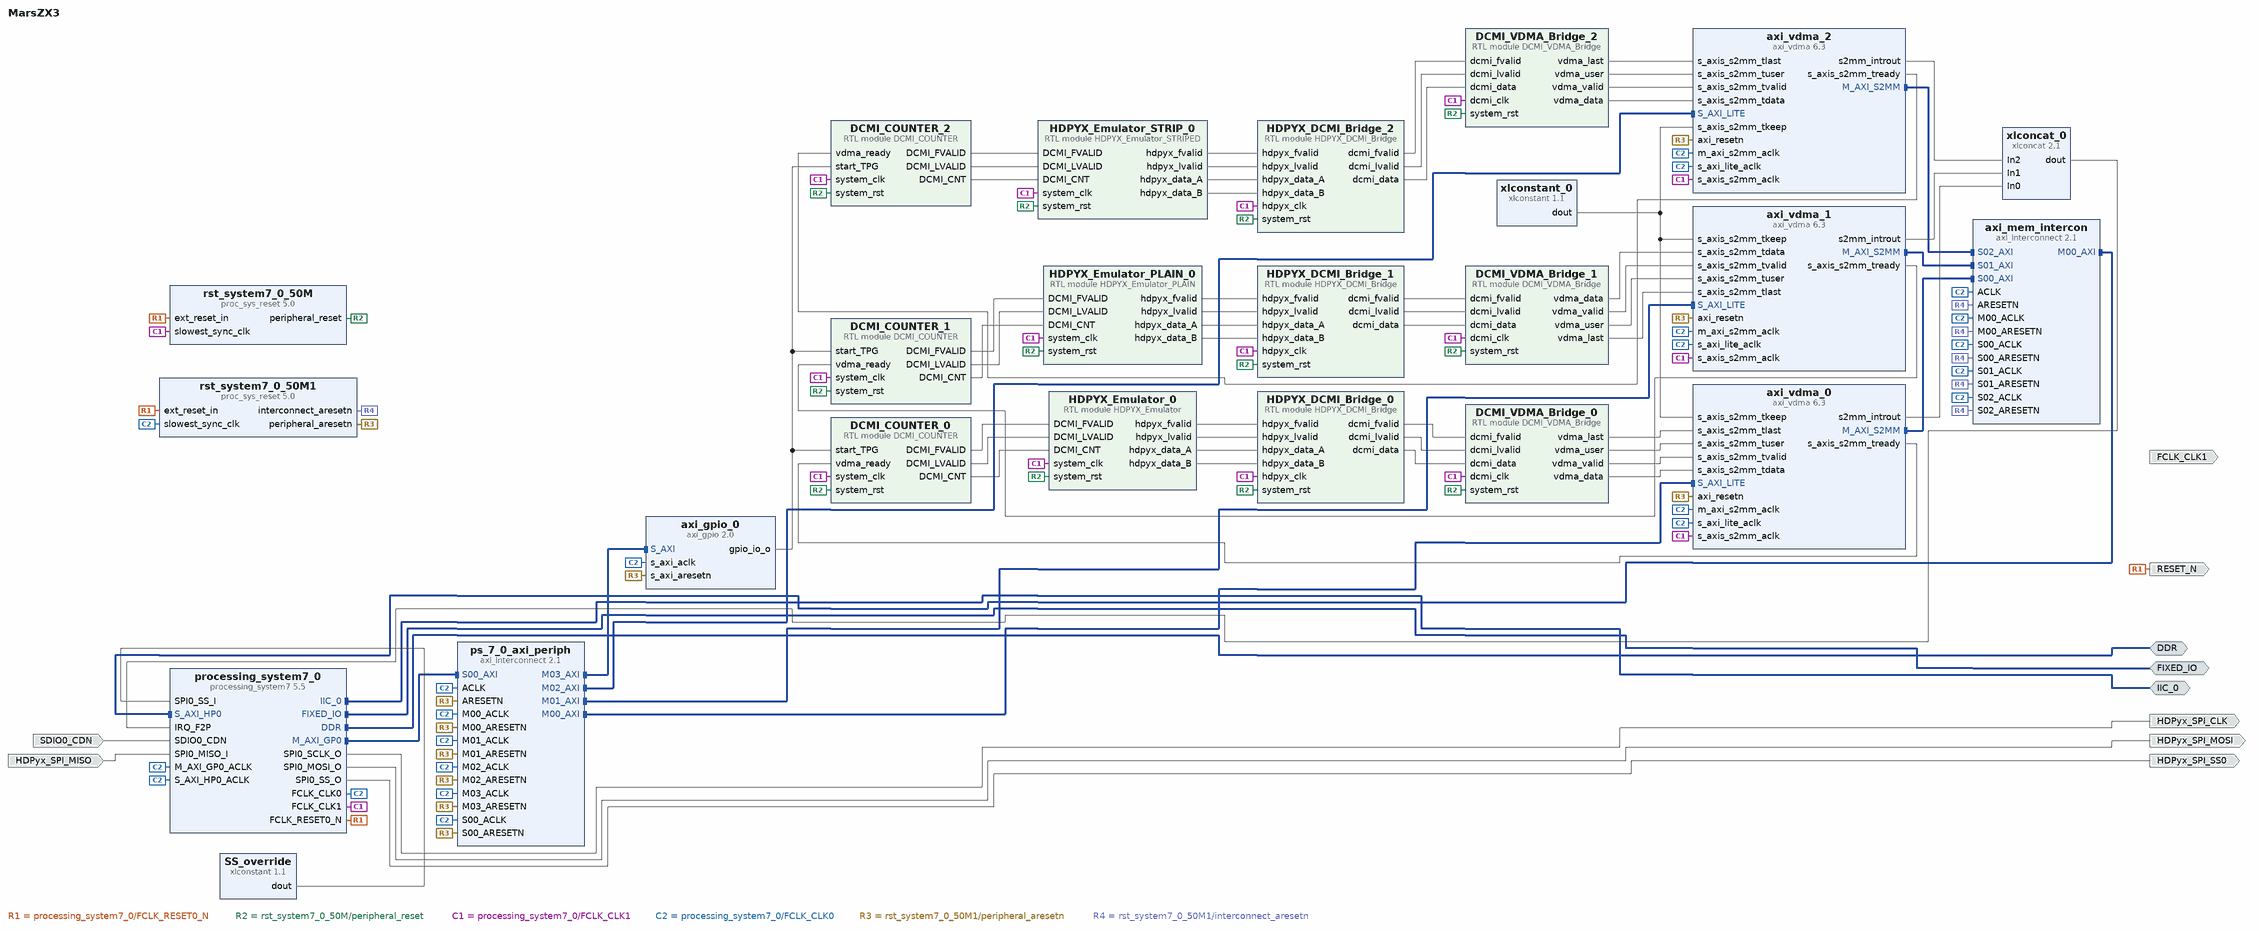
[diagram p0: block diagram of the top level]
# Vivado block design MarsZX3, xc7z020clg484-1, Vivado 2019.1
create_bd_design MarsZX3

create_bd_intf_port -mode Master -vlnv xilinx.com:interface:ddrx_rtl:1.0 DDR
create_bd_intf_port -mode Master -vlnv xilinx.com:display_processing_system7:fixedio_rtl:1.0 FIXED_IO
create_bd_intf_port -mode Master -vlnv xilinx.com:interface:iic_rtl:1.0 IIC_0
create_bd_port -dir I SDIO0_CDN
create_bd_port -dir O -type clk FCLK_CLK1
create_bd_port -dir O RESET_N
create_bd_port -dir O -type clk HDPyx_SPI_CLK
create_bd_port -dir O HDPyx_SPI_MOSI
create_bd_port -dir I HDPyx_SPI_MISO
create_bd_port -dir O HDPyx_SPI_SS0

create_bd_cell -type ip -vlnv xilinx.com:ip:processing_system7:5.5 processing_system7_0
set_property -dict [list \
  CONFIG.PCW_APU_PERIPHERAL_FREQMHZ 666.666666 \
  CONFIG.PCW_ENET0_ENET0_IO {MIO 16 .. 27} \
  CONFIG.PCW_ENET0_GRP_MDIO_ENABLE 1 \
  CONFIG.PCW_ENET0_GRP_MDIO_IO {MIO 52 .. 53} \
  CONFIG.PCW_ENET0_PERIPHERAL_ENABLE 1 \
  CONFIG.PCW_ENET_RESET_ENABLE 0 \
  CONFIG.PCW_EN_CLK1_PORT 1 \
  CONFIG.PCW_FCLK_CLK1_BUF TRUE \
  CONFIG.PCW_FPGA0_PERIPHERAL_FREQMHZ 100 \
  CONFIG.PCW_FPGA1_PERIPHERAL_FREQMHZ 50 \
  CONFIG.PCW_FPGA2_PERIPHERAL_FREQMHZ 40 \
  CONFIG.PCW_FPGA3_PERIPHERAL_FREQMHZ 33.333 \
  CONFIG.PCW_FPGA_FCLK1_ENABLE 1 \
  CONFIG.PCW_GP0_EN_MODIFIABLE_TXN 0 \
  CONFIG.PCW_GP1_EN_MODIFIABLE_TXN 0 \
  CONFIG.PCW_GPIO_MIO_GPIO_ENABLE 1 \
  CONFIG.PCW_GPIO_MIO_GPIO_IO MIO \
  CONFIG.PCW_I2C0_I2C0_IO EMIO \
  CONFIG.PCW_I2C0_PERIPHERAL_ENABLE 1 \
  CONFIG.PCW_I2C_PERIPHERAL_FREQMHZ 111.111115 \
  CONFIG.PCW_I2C_RESET_ENABLE 0 \
  CONFIG.PCW_IRQ_F2P_INTR 1 \
  CONFIG.PCW_PERIPHERAL_BOARD_PRESET None \
  CONFIG.PCW_PRESET_BANK0_VOLTAGE {LVCMOS 2.5V} \
  CONFIG.PCW_PRESET_BANK1_VOLTAGE {LVCMOS 2.5V} \
  CONFIG.PCW_QSPI_GRP_FBCLK_ENABLE 1 \
  CONFIG.PCW_QSPI_GRP_FBCLK_IO {MIO 8} \
  CONFIG.PCW_QSPI_GRP_SINGLE_SS_ENABLE 1 \
  CONFIG.PCW_QSPI_GRP_SINGLE_SS_IO {MIO 1 .. 6} \
  CONFIG.PCW_QSPI_PERIPHERAL_ENABLE 1 \
  CONFIG.PCW_QSPI_PERIPHERAL_FREQMHZ 125 \
  CONFIG.PCW_QSPI_QSPI_IO {MIO 1 .. 6} \
  CONFIG.PCW_SD0_GRP_CD_ENABLE 1 \
  CONFIG.PCW_SD0_GRP_CD_IO EMIO \
  CONFIG.PCW_SD0_GRP_WP_ENABLE 1 \
  CONFIG.PCW_SD0_GRP_WP_IO EMIO \
  CONFIG.PCW_SD0_PERIPHERAL_ENABLE 1 \
  CONFIG.PCW_SD0_SD0_IO {MIO 40 .. 45} \
  CONFIG.PCW_SDIO_PERIPHERAL_FREQMHZ 50 \
  CONFIG.PCW_SINGLE_QSPI_DATA_MODE x4 \
  CONFIG.PCW_SPI0_PERIPHERAL_ENABLE 1 \
  CONFIG.PCW_SPI0_SPI0_IO EMIO \
  CONFIG.PCW_TPIU_PERIPHERAL_CLKSRC {IO PLL} \
  CONFIG.PCW_TTC0_PERIPHERAL_ENABLE 1 \
  CONFIG.PCW_TTC0_TTC0_IO EMIO \
  CONFIG.PCW_UART0_PERIPHERAL_ENABLE 1 \
  CONFIG.PCW_UART0_UART0_IO {MIO 46 .. 47} \
  CONFIG.PCW_UART1_PERIPHERAL_ENABLE 0 \
  CONFIG.PCW_UART_PERIPHERAL_FREQMHZ 100 \
  CONFIG.PCW_UIPARAM_DDR_FREQ_MHZ 400 \
  CONFIG.PCW_UIPARAM_DDR_MEMORY_TYPE {DDR 3 (Low Voltage)} \
  CONFIG.PCW_UIPARAM_DDR_PARTNO Custom \
  CONFIG.PCW_USB0_PERIPHERAL_ENABLE 1 \
  CONFIG.PCW_USB0_USB0_IO {MIO 28 .. 39} \
  CONFIG.PCW_USB_RESET_ENABLE 0 \
  CONFIG.PCW_USE_FABRIC_INTERRUPT 1 \
  CONFIG.PCW_USE_S_AXI_HP0 1 \
  CONFIG.PCW_WDT_PERIPHERAL_ENABLE 1 \
  CONFIG.PCW_WDT_WDT_IO EMIO \
] [get_bd_cells processing_system7_0]
# 522 more settings of processing_system7_0 are not shown: defaults, MIO pin electricals, DDR timing, and values the tool derives
create_bd_cell -type ip -vlnv xilinx.com:ip:axi_gpio:2.0 axi_gpio_0
set_property -dict {CONFIG.C_ALL_OUTPUTS 1 CONFIG.C_GPIO_WIDTH 1} [get_bd_cells axi_gpio_0]
create_bd_cell -type ip -vlnv xilinx.com:ip:axi_interconnect:2.1 axi_mem_intercon
set_property -dict {CONFIG.NUM_MI 1 CONFIG.NUM_SI 3 CONFIG.SYNCHRONIZATION_STAGES 2} [get_bd_cells axi_mem_intercon]
create_bd_cell -type ip -vlnv xilinx.com:ip:axi_interconnect:2.1 ps_7_0_axi_periph
set_property -dict {CONFIG.NUM_MI 4 CONFIG.SYNCHRONIZATION_STAGES 2} [get_bd_cells ps_7_0_axi_periph]
create_bd_cell -type ip -vlnv xilinx.com:ip:proc_sys_reset:5.0 rst_system7_0_50M
create_bd_cell -type ip -vlnv xilinx.com:ip:xlconstant:1.1 SS_override
create_bd_cell -type ip -vlnv xilinx.com:ip:axi_vdma:6.3 axi_vdma_0
set_property -dict [list \
  CONFIG.c_include_mm2s 0 \
  CONFIG.c_include_s2mm_dre 1 \
  CONFIG.c_num_fstores 3 \
  CONFIG.c_s2mm_max_burst_length 2 \
  CONFIG.c_use_s2mm_fsync 0 \
] [get_bd_cells axi_vdma_0]
create_bd_cell -type module -reference DCMI_VDMA_Bridge DCMI_VDMA_Bridge_0
create_bd_cell -type ip -vlnv xilinx.com:ip:xlconstant:1.1 xlconstant_0
set_property -dict {CONFIG.CONST_VAL 3 CONFIG.CONST_WIDTH 2} [get_bd_cells xlconstant_0]
create_bd_cell -type module -reference DCMI_VDMA_Bridge DCMI_VDMA_Bridge_1
create_bd_cell -type module -reference DCMI_VDMA_Bridge DCMI_VDMA_Bridge_2
create_bd_cell -type ip -vlnv xilinx.com:ip:axi_vdma:6.3 axi_vdma_1
set_property -dict [list \
  CONFIG.c_include_mm2s 0 \
  CONFIG.c_include_s2mm_dre 1 \
  CONFIG.c_num_fstores 3 \
  CONFIG.c_s2mm_max_burst_length 2 \
  CONFIG.c_use_s2mm_fsync 0 \
] [get_bd_cells axi_vdma_1]
create_bd_cell -type ip -vlnv xilinx.com:ip:axi_vdma:6.3 axi_vdma_2
set_property -dict [list \
  CONFIG.c_include_mm2s 0 \
  CONFIG.c_include_s2mm_dre 1 \
  CONFIG.c_num_fstores 3 \
  CONFIG.c_s2mm_max_burst_length 2 \
  CONFIG.c_use_s2mm_fsync 0 \
] [get_bd_cells axi_vdma_2]
create_bd_cell -type ip -vlnv xilinx.com:ip:xlconcat:2.1 xlconcat_0
set_property -dict {CONFIG.NUM_PORTS 3} [get_bd_cells xlconcat_0]
create_bd_cell -type ip -vlnv xilinx.com:ip:proc_sys_reset:5.0 rst_system7_0_50M1
create_bd_cell -type module -reference HDPYX_DCMI_Bridge HDPYX_DCMI_Bridge_0
create_bd_cell -type module -reference HDPYX_DCMI_Bridge HDPYX_DCMI_Bridge_1
create_bd_cell -type module -reference HDPYX_DCMI_Bridge HDPYX_DCMI_Bridge_2
create_bd_cell -type module -reference DCMI_COUNTER DCMI_COUNTER_0
create_bd_cell -type module -reference DCMI_COUNTER DCMI_COUNTER_1
create_bd_cell -type module -reference DCMI_COUNTER DCMI_COUNTER_2
create_bd_cell -type module -reference HDPYX_Emulator HDPYX_Emulator_0
create_bd_cell -type module -reference HDPYX_Emulator_PLAIN HDPYX_Emulator_PLAIN_0
create_bd_cell -type module -reference HDPYX_Emulator_STRIPED HDPYX_Emulator_STRIP_0

# ---- connections ----

connect_bd_intf_net [get_bd_intf_ports IIC_0] [get_bd_intf_pins processing_system7_0/IIC_0]
connect_bd_intf_net [get_bd_intf_ports FIXED_IO] [get_bd_intf_pins processing_system7_0/FIXED_IO]
connect_bd_intf_net [get_bd_intf_pins ps_7_0_axi_periph/S00_AXI] [get_bd_intf_pins processing_system7_0/M_AXI_GP0]
connect_bd_intf_net [get_bd_intf_pins axi_mem_intercon/M00_AXI] [get_bd_intf_pins processing_system7_0/S_AXI_HP0]
connect_bd_intf_net [get_bd_intf_pins ps_7_0_axi_periph/M02_AXI] [get_bd_intf_pins axi_vdma_2/S_AXI_LITE]
connect_bd_intf_net [get_bd_intf_ports DDR] [get_bd_intf_pins processing_system7_0/DDR]
connect_bd_intf_net [get_bd_intf_pins ps_7_0_axi_periph/M01_AXI] [get_bd_intf_pins axi_vdma_1/S_AXI_LITE]
connect_bd_intf_net [get_bd_intf_pins axi_gpio_0/S_AXI] [get_bd_intf_pins ps_7_0_axi_periph/M03_AXI]
connect_bd_intf_net [get_bd_intf_pins axi_vdma_2/M_AXI_S2MM] [get_bd_intf_pins axi_mem_intercon/S02_AXI]
connect_bd_intf_net [get_bd_intf_pins axi_mem_intercon/S00_AXI] [get_bd_intf_pins axi_vdma_0/M_AXI_S2MM]
connect_bd_intf_net [get_bd_intf_pins axi_vdma_0/S_AXI_LITE] [get_bd_intf_pins ps_7_0_axi_periph/M00_AXI]
connect_bd_intf_net [get_bd_intf_pins axi_vdma_1/M_AXI_S2MM] [get_bd_intf_pins axi_mem_intercon/S01_AXI]
connect_bd_net [get_bd_ports SDIO0_CDN] [get_bd_pins processing_system7_0/SDIO0_CDN]
connect_bd_net [get_bd_pins processing_system7_0/FCLK_RESET0_N] \
  [get_bd_ports RESET_N] [get_bd_pins rst_system7_0_50M/ext_reset_in] [get_bd_pins rst_system7_0_50M1/ext_reset_in]
connect_bd_net [get_bd_pins processing_system7_0/SPI0_SCLK_O] [get_bd_ports HDPyx_SPI_CLK]
connect_bd_net [get_bd_pins processing_system7_0/SPI0_MOSI_O] [get_bd_ports HDPyx_SPI_MOSI]
connect_bd_net [get_bd_ports HDPyx_SPI_MISO] [get_bd_pins processing_system7_0/SPI0_MISO_I]
connect_bd_net [get_bd_pins processing_system7_0/SPI0_SS_O] [get_bd_ports HDPyx_SPI_SS0]
connect_bd_net -net xlconstant_0_dout [get_bd_pins SS_override/dout] [get_bd_pins processing_system7_0/SPI0_SS_I]
connect_bd_net [get_bd_pins rst_system7_0_50M/peripheral_reset] \
  [get_bd_pins DCMI_VDMA_Bridge_0/system_rst] [get_bd_pins DCMI_VDMA_Bridge_1/system_rst] \
  [get_bd_pins DCMI_VDMA_Bridge_2/system_rst] [get_bd_pins HDPYX_DCMI_Bridge_0/system_rst] \
  [get_bd_pins HDPYX_DCMI_Bridge_1/system_rst] [get_bd_pins HDPYX_DCMI_Bridge_2/system_rst] \
  [get_bd_pins DCMI_COUNTER_0/system_rst] [get_bd_pins DCMI_COUNTER_1/system_rst] [get_bd_pins DCMI_COUNTER_2/system_rst] \
  [get_bd_pins HDPYX_Emulator_0/system_rst] [get_bd_pins HDPYX_Emulator_PLAIN_0/system_rst] \
  [get_bd_pins HDPYX_Emulator_STRIP_0/system_rst]
connect_bd_net [get_bd_pins HDPYX_DCMI_Bridge_0/dcmi_fvalid] [get_bd_pins DCMI_VDMA_Bridge_0/dcmi_fvalid]
connect_bd_net [get_bd_pins HDPYX_Emulator_0/hdpyx_fvalid] [get_bd_pins HDPYX_DCMI_Bridge_0/hdpyx_fvalid]
connect_bd_net [get_bd_pins HDPYX_Emulator_0/hdpyx_lvalid] [get_bd_pins HDPYX_DCMI_Bridge_0/hdpyx_lvalid]
connect_bd_net [get_bd_pins xlconstant_0/dout] \
  [get_bd_pins axi_vdma_0/s_axis_s2mm_tkeep] [get_bd_pins axi_vdma_1/s_axis_s2mm_tkeep] \
  [get_bd_pins axi_vdma_2/s_axis_s2mm_tkeep]
connect_bd_net [get_bd_pins processing_system7_0/FCLK_CLK1] \
  [get_bd_pins DCMI_VDMA_Bridge_0/dcmi_clk] [get_bd_pins axi_vdma_0/s_axis_s2mm_aclk] \
  [get_bd_pins rst_system7_0_50M/slowest_sync_clk] [get_bd_pins DCMI_VDMA_Bridge_1/dcmi_clk] \
  [get_bd_pins DCMI_VDMA_Bridge_2/dcmi_clk] [get_bd_pins axi_vdma_1/s_axis_s2mm_aclk] \
  [get_bd_pins axi_vdma_2/s_axis_s2mm_aclk] [get_bd_pins HDPYX_DCMI_Bridge_0/hdpyx_clk] \
  [get_bd_pins HDPYX_DCMI_Bridge_1/hdpyx_clk] [get_bd_pins HDPYX_DCMI_Bridge_2/hdpyx_clk] \
  [get_bd_pins DCMI_COUNTER_0/system_clk] [get_bd_pins DCMI_COUNTER_1/system_clk] [get_bd_pins DCMI_COUNTER_2/system_clk] \
  [get_bd_pins HDPYX_Emulator_0/system_clk] [get_bd_pins HDPYX_Emulator_PLAIN_0/system_clk] \
  [get_bd_pins HDPYX_Emulator_STRIP_0/system_clk]
connect_bd_net [get_bd_pins processing_system7_0/FCLK_CLK0] \
  [get_bd_pins axi_vdma_0/s_axi_lite_aclk] [get_bd_pins axi_vdma_0/m_axi_s2mm_aclk] [get_bd_pins axi_gpio_0/s_axi_aclk] \
  [get_bd_pins ps_7_0_axi_periph/ACLK] [get_bd_pins ps_7_0_axi_periph/S00_ACLK] [get_bd_pins ps_7_0_axi_periph/M00_ACLK] \
  [get_bd_pins ps_7_0_axi_periph/M01_ACLK] [get_bd_pins ps_7_0_axi_periph/M02_ACLK] [get_bd_pins axi_mem_intercon/ACLK] \
  [get_bd_pins axi_mem_intercon/S00_ACLK] [get_bd_pins axi_mem_intercon/M00_ACLK] \
  [get_bd_pins processing_system7_0/S_AXI_HP0_ACLK] [get_bd_pins ps_7_0_axi_periph/M03_ACLK] \
  [get_bd_pins axi_mem_intercon/S01_ACLK] [get_bd_pins axi_mem_intercon/S02_ACLK] [get_bd_pins axi_vdma_1/s_axi_lite_aclk] \
  [get_bd_pins axi_vdma_1/m_axi_s2mm_aclk] [get_bd_pins axi_vdma_2/s_axi_lite_aclk] [get_bd_pins axi_vdma_2/m_axi_s2mm_aclk] \
  [get_bd_pins rst_system7_0_50M1/slowest_sync_clk] [get_bd_pins processing_system7_0/M_AXI_GP0_ACLK]
connect_bd_net [get_bd_pins DCMI_VDMA_Bridge_0/vdma_last] [get_bd_pins axi_vdma_0/s_axis_s2mm_tlast]
connect_bd_net [get_bd_pins DCMI_VDMA_Bridge_0/vdma_user] [get_bd_pins axi_vdma_0/s_axis_s2mm_tuser]
connect_bd_net [get_bd_pins DCMI_VDMA_Bridge_0/vdma_valid] [get_bd_pins axi_vdma_0/s_axis_s2mm_tvalid]
connect_bd_net [get_bd_pins DCMI_VDMA_Bridge_0/vdma_data] [get_bd_pins axi_vdma_0/s_axis_s2mm_tdata]
connect_bd_net [get_bd_pins HDPYX_Emulator_0/hdpyx_data_A] [get_bd_pins HDPYX_DCMI_Bridge_0/hdpyx_data_A]
connect_bd_net [get_bd_pins HDPYX_Emulator_0/hdpyx_data_B] [get_bd_pins HDPYX_DCMI_Bridge_0/hdpyx_data_B]
connect_bd_net [get_bd_pins HDPYX_DCMI_Bridge_0/dcmi_lvalid] [get_bd_pins DCMI_VDMA_Bridge_0/dcmi_lvalid]
connect_bd_net [get_bd_pins HDPYX_DCMI_Bridge_0/dcmi_data] [get_bd_pins DCMI_VDMA_Bridge_0/dcmi_data]
connect_bd_net [get_bd_pins HDPYX_DCMI_Bridge_1/dcmi_fvalid] [get_bd_pins DCMI_VDMA_Bridge_1/dcmi_fvalid]
connect_bd_net [get_bd_pins HDPYX_DCMI_Bridge_1/dcmi_lvalid] [get_bd_pins DCMI_VDMA_Bridge_1/dcmi_lvalid]
connect_bd_net [get_bd_pins HDPYX_DCMI_Bridge_1/dcmi_data] [get_bd_pins DCMI_VDMA_Bridge_1/dcmi_data]
connect_bd_net [get_bd_pins HDPYX_DCMI_Bridge_2/dcmi_fvalid] [get_bd_pins DCMI_VDMA_Bridge_2/dcmi_fvalid]
connect_bd_net [get_bd_pins HDPYX_DCMI_Bridge_2/dcmi_lvalid] [get_bd_pins DCMI_VDMA_Bridge_2/dcmi_lvalid]
connect_bd_net [get_bd_pins HDPYX_DCMI_Bridge_2/dcmi_data] [get_bd_pins DCMI_VDMA_Bridge_2/dcmi_data]
connect_bd_net [get_bd_pins xlconcat_0/dout] [get_bd_pins processing_system7_0/IRQ_F2P]
connect_bd_net [get_bd_pins axi_vdma_0/s2mm_introut] [get_bd_pins xlconcat_0/In0]
connect_bd_net [get_bd_pins axi_vdma_1/s2mm_introut] [get_bd_pins xlconcat_0/In1]
connect_bd_net [get_bd_pins axi_vdma_2/s2mm_introut] [get_bd_pins xlconcat_0/In2]
connect_bd_net [get_bd_pins DCMI_VDMA_Bridge_1/vdma_data] [get_bd_pins axi_vdma_1/s_axis_s2mm_tdata]
connect_bd_net [get_bd_pins DCMI_VDMA_Bridge_1/vdma_valid] [get_bd_pins axi_vdma_1/s_axis_s2mm_tvalid]
connect_bd_net [get_bd_pins DCMI_VDMA_Bridge_1/vdma_user] [get_bd_pins axi_vdma_1/s_axis_s2mm_tuser]
connect_bd_net [get_bd_pins DCMI_VDMA_Bridge_1/vdma_last] [get_bd_pins axi_vdma_1/s_axis_s2mm_tlast]
connect_bd_net [get_bd_pins DCMI_VDMA_Bridge_2/vdma_last] [get_bd_pins axi_vdma_2/s_axis_s2mm_tlast]
connect_bd_net [get_bd_pins DCMI_VDMA_Bridge_2/vdma_user] [get_bd_pins axi_vdma_2/s_axis_s2mm_tuser]
connect_bd_net [get_bd_pins DCMI_VDMA_Bridge_2/vdma_valid] [get_bd_pins axi_vdma_2/s_axis_s2mm_tvalid]
connect_bd_net [get_bd_pins DCMI_VDMA_Bridge_2/vdma_data] [get_bd_pins axi_vdma_2/s_axis_s2mm_tdata]
connect_bd_net [get_bd_pins DCMI_COUNTER_0/DCMI_FVALID] [get_bd_pins HDPYX_Emulator_0/DCMI_FVALID]
connect_bd_net [get_bd_pins DCMI_COUNTER_0/DCMI_LVALID] [get_bd_pins HDPYX_Emulator_0/DCMI_LVALID]
connect_bd_net [get_bd_pins DCMI_COUNTER_0/DCMI_CNT] [get_bd_pins HDPYX_Emulator_0/DCMI_CNT]
connect_bd_net [get_bd_pins axi_gpio_0/gpio_io_o] \
  [get_bd_pins DCMI_COUNTER_0/start_TPG] [get_bd_pins DCMI_COUNTER_1/start_TPG] [get_bd_pins DCMI_COUNTER_2/start_TPG]
connect_bd_net [get_bd_pins axi_vdma_0/s_axis_s2mm_tready] [get_bd_pins DCMI_COUNTER_0/vdma_ready]
connect_bd_net [get_bd_pins axi_vdma_1/s_axis_s2mm_tready] [get_bd_pins DCMI_COUNTER_1/vdma_ready]
connect_bd_net [get_bd_pins axi_vdma_2/s_axis_s2mm_tready] [get_bd_pins DCMI_COUNTER_2/vdma_ready]
connect_bd_net [get_bd_pins rst_system7_0_50M1/peripheral_aresetn] \
  [get_bd_pins ps_7_0_axi_periph/M03_ARESETN] [get_bd_pins ps_7_0_axi_periph/M02_ARESETN] \
  [get_bd_pins ps_7_0_axi_periph/M01_ARESETN] [get_bd_pins ps_7_0_axi_periph/M00_ARESETN] \
  [get_bd_pins ps_7_0_axi_periph/S00_ARESETN] [get_bd_pins ps_7_0_axi_periph/ARESETN] [get_bd_pins axi_vdma_2/axi_resetn] \
  [get_bd_pins axi_vdma_0/axi_resetn] [get_bd_pins axi_vdma_1/axi_resetn] [get_bd_pins axi_gpio_0/s_axi_aresetn]
connect_bd_net [get_bd_pins rst_system7_0_50M1/interconnect_aresetn] \
  [get_bd_pins axi_mem_intercon/S02_ARESETN] [get_bd_pins axi_mem_intercon/S01_ARESETN] \
  [get_bd_pins axi_mem_intercon/M00_ARESETN] [get_bd_pins axi_mem_intercon/S00_ARESETN] \
  [get_bd_pins axi_mem_intercon/ARESETN]
connect_bd_net [get_bd_pins DCMI_COUNTER_1/DCMI_FVALID] [get_bd_pins HDPYX_Emulator_PLAIN_0/DCMI_FVALID]
connect_bd_net [get_bd_pins DCMI_COUNTER_1/DCMI_LVALID] [get_bd_pins HDPYX_Emulator_PLAIN_0/DCMI_LVALID]
connect_bd_net [get_bd_pins DCMI_COUNTER_1/DCMI_CNT] [get_bd_pins HDPYX_Emulator_PLAIN_0/DCMI_CNT]
connect_bd_net [get_bd_pins HDPYX_Emulator_PLAIN_0/hdpyx_fvalid] [get_bd_pins HDPYX_DCMI_Bridge_1/hdpyx_fvalid]
connect_bd_net [get_bd_pins HDPYX_Emulator_PLAIN_0/hdpyx_lvalid] [get_bd_pins HDPYX_DCMI_Bridge_1/hdpyx_lvalid]
connect_bd_net [get_bd_pins HDPYX_Emulator_PLAIN_0/hdpyx_data_A] [get_bd_pins HDPYX_DCMI_Bridge_1/hdpyx_data_A]
connect_bd_net [get_bd_pins HDPYX_Emulator_PLAIN_0/hdpyx_data_B] [get_bd_pins HDPYX_DCMI_Bridge_1/hdpyx_data_B]
connect_bd_net [get_bd_pins DCMI_COUNTER_2/DCMI_FVALID] [get_bd_pins HDPYX_Emulator_STRIP_0/DCMI_FVALID]
connect_bd_net [get_bd_pins DCMI_COUNTER_2/DCMI_LVALID] [get_bd_pins HDPYX_Emulator_STRIP_0/DCMI_LVALID]
connect_bd_net [get_bd_pins DCMI_COUNTER_2/DCMI_CNT] [get_bd_pins HDPYX_Emulator_STRIP_0/DCMI_CNT]
connect_bd_net [get_bd_pins HDPYX_Emulator_STRIP_0/hdpyx_fvalid] [get_bd_pins HDPYX_DCMI_Bridge_2/hdpyx_fvalid]
connect_bd_net [get_bd_pins HDPYX_Emulator_STRIP_0/hdpyx_lvalid] [get_bd_pins HDPYX_DCMI_Bridge_2/hdpyx_lvalid]
connect_bd_net [get_bd_pins HDPYX_Emulator_STRIP_0/hdpyx_data_A] [get_bd_pins HDPYX_DCMI_Bridge_2/hdpyx_data_A]
connect_bd_net [get_bd_pins HDPYX_Emulator_STRIP_0/hdpyx_data_B] [get_bd_pins HDPYX_DCMI_Bridge_2/hdpyx_data_B]

# ---- address map ----
assign_bd_address -offset 0x00000000 -range 1G -target_address_space [get_bd_addr_spaces axi_vdma_0/Data_S2MM] [get_bd_addr_segs processing_system7_0/S_AXI_HP0/HP0_DDR_LOWOCM]
assign_bd_address -offset 0x00000000 -range 1G -target_address_space [get_bd_addr_spaces axi_vdma_1/Data_S2MM] [get_bd_addr_segs processing_system7_0/S_AXI_HP0/HP0_DDR_LOWOCM]
assign_bd_address -offset 0x00000000 -range 1G -target_address_space [get_bd_addr_spaces axi_vdma_2/Data_S2MM] [get_bd_addr_segs processing_system7_0/S_AXI_HP0/HP0_DDR_LOWOCM]
assign_bd_address -offset 0x41200000 -range 64K -target_address_space [get_bd_addr_spaces processing_system7_0/Data] [get_bd_addr_segs axi_gpio_0/S_AXI/Reg]
assign_bd_address -offset 0x43000000 -range 64K -target_address_space [get_bd_addr_spaces processing_system7_0/Data] [get_bd_addr_segs axi_vdma_0/S_AXI_LITE/Reg]
assign_bd_address -offset 0x43010000 -range 64K -target_address_space [get_bd_addr_spaces processing_system7_0/Data] [get_bd_addr_segs axi_vdma_1/S_AXI_LITE/Reg]
assign_bd_address -offset 0x43020000 -range 64K -target_address_space [get_bd_addr_spaces processing_system7_0/Data] [get_bd_addr_segs axi_vdma_2/S_AXI_LITE/Reg]

validate_bd_design
save_bd_design
